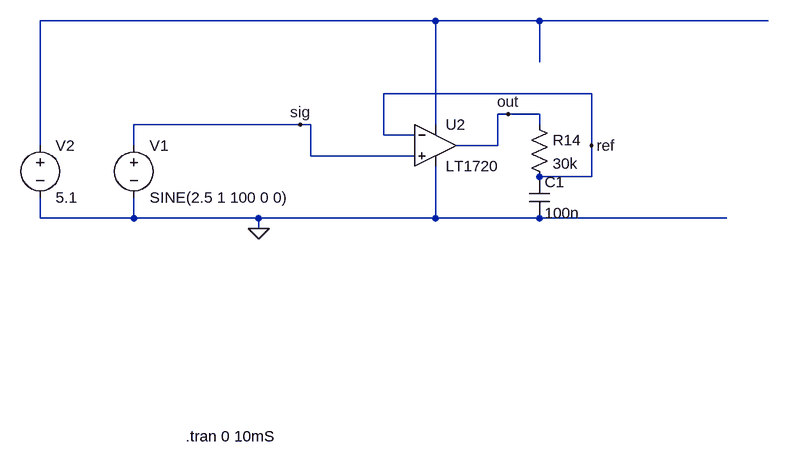
[diagram p0: schematic delta_sigma.asc]
delta_sigma.asc, the LTspice schematic file:
Version 4
SHEET 1 5176 960
WIRE 2048 -688 1440 -688
WIRE 2208 -688 2048 -688
WIRE 2560 -688 2208 -688
WIRE 2208 -624 2208 -688
WIRE 2288 -576 1968 -576
WIRE 2160 -544 2144 -544
WIRE 2208 -544 2160 -544
WIRE 1840 -528 1584 -528
WIRE 1856 -528 1840 -528
WIRE 2048 -528 2048 -688
WIRE 2208 -528 2208 -544
WIRE 1968 -512 1968 -576
WIRE 2016 -512 1968 -512
WIRE 1440 -496 1440 -688
WIRE 1584 -496 1584 -528
WIRE 2144 -496 2144 -544
WIRE 2144 -496 2080 -496
WIRE 2288 -496 2288 -576
WIRE 1856 -480 1856 -528
WIRE 2016 -480 1856 -480
WIRE 2288 -448 2288 -496
WIRE 2288 -448 2208 -448
WIRE 1440 -384 1440 -416
WIRE 1584 -384 1584 -416
WIRE 1584 -384 1440 -384
WIRE 1776 -384 1584 -384
WIRE 2048 -384 2048 -464
WIRE 2048 -384 1776 -384
WIRE 2208 -384 2048 -384
WIRE 2496 -384 2208 -384
WIRE 1776 -368 1776 -384
FLAG 1776 -368 0
FLAG 1840 -528 sig
FLAG 2160 -544 out
FLAG 2288 -496 ref
SYMBOL cap 2192 -448 R0
SYMATTR InstName C1
SYMATTR Value 100n
SYMBOL res 2192 -544 R0
SYMATTR InstName R14
SYMATTR Value 30k
SYMBOL voltage 1584 -512 R0
SYMATTR InstName V1
SYMATTR Value SINE(2.5 1 100 0 0)
SYMATTR SpiceLine Rser=1
SYMBOL voltage 1440 -512 R0
SYMATTR InstName V2
SYMATTR Value 5.1
SYMATTR SpiceLine Rser=0
SYMBOL Comparators/LT1720 2048 -560 R0
SYMATTR InstName U2
TEXT 1664 -48 Left 2 !.tran 0 10mS

The netlist it stands for:
* delta_sigma.asc
C1 ref 0 100n
R14 out ref 30k
V1 sig 0 SINE(2.5 1 100 0 0) Rser=1
V2 N001 0 5.1 Rser=0
XU2 sig ref N001 0 out LT1720  ; pins In+ In- V+ V- OUT
.tran 0 10mS
.lib LT1720.sub
.backanno
.end